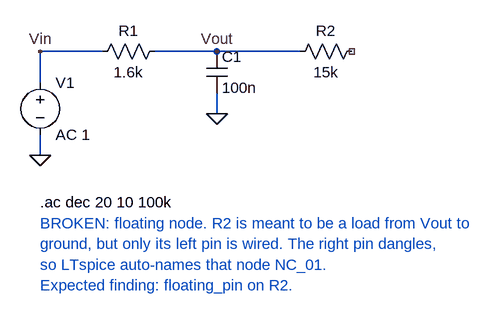
[diagram p0: schematic floating_node.asc]
floating_node.asc, the LTspice schematic file:
Version 4.1
SHEET 1 880 680
WIRE 0 -32 96 -32
WIRE 176 -32 272 -32
WIRE 0 16 0 -32
WIRE 0 128 0 96
WIRE 272 32 272 64
WIRE 272 -32 400 -32
FLAG 0 128 0
FLAG 272 64 0
FLAG 0 -32 Vin
FLAG 272 -32 Vout
SYMBOL voltage 0 0 R0
WINDOW 123 24 124 Left 2
WINDOW 39 0 0 Left 0
SYMATTR InstName V1
SYMATTR Value AC 1
SYMBOL res 192 -48 R90
WINDOW 0 0 56 VBottom 2
WINDOW 3 32 56 VTop 2
SYMATTR InstName R1
SYMATTR Value 1.6k
SYMBOL cap 256 -32 R0
SYMATTR InstName C1
SYMATTR Value 100n
SYMBOL res 496 -48 R90
WINDOW 0 0 56 VBottom 2
WINDOW 3 32 56 VTop 2
SYMATTR InstName R2
SYMATTR Value 15k
TEXT 0 200 Left 2 !.ac dec 20 10 100k
TEXT 0 232 Left 2 ;BROKEN: floating node. R2 is meant to be a load from Vout to
TEXT 0 264 Left 2 ;ground, but only its left pin is wired. The right pin dangles,
TEXT 0 296 Left 2 ;so LTspice auto-names that node NC_01.
TEXT 0 328 Left 2 ;Expected finding: floating_pin on R2.

The netlist it stands for:
* floating_node.asc
V1 Vin 0 AC 1
R1 Vout Vin 1.6k
C1 Vout 0 100n
R2 NC_01 Vout 15k
.ac dec 20 10 100k
* BROKEN: floating node. R2 is meant to be a load from Vout to
* ground, but only its left pin is wired. The right pin dangles,
* so LTspice auto-names that node NC_01.
* Expected finding: floating_pin on R2.
.backanno
.end